# EAGLE schematic MeeBooster_synth (EAGLE 7.5.0)
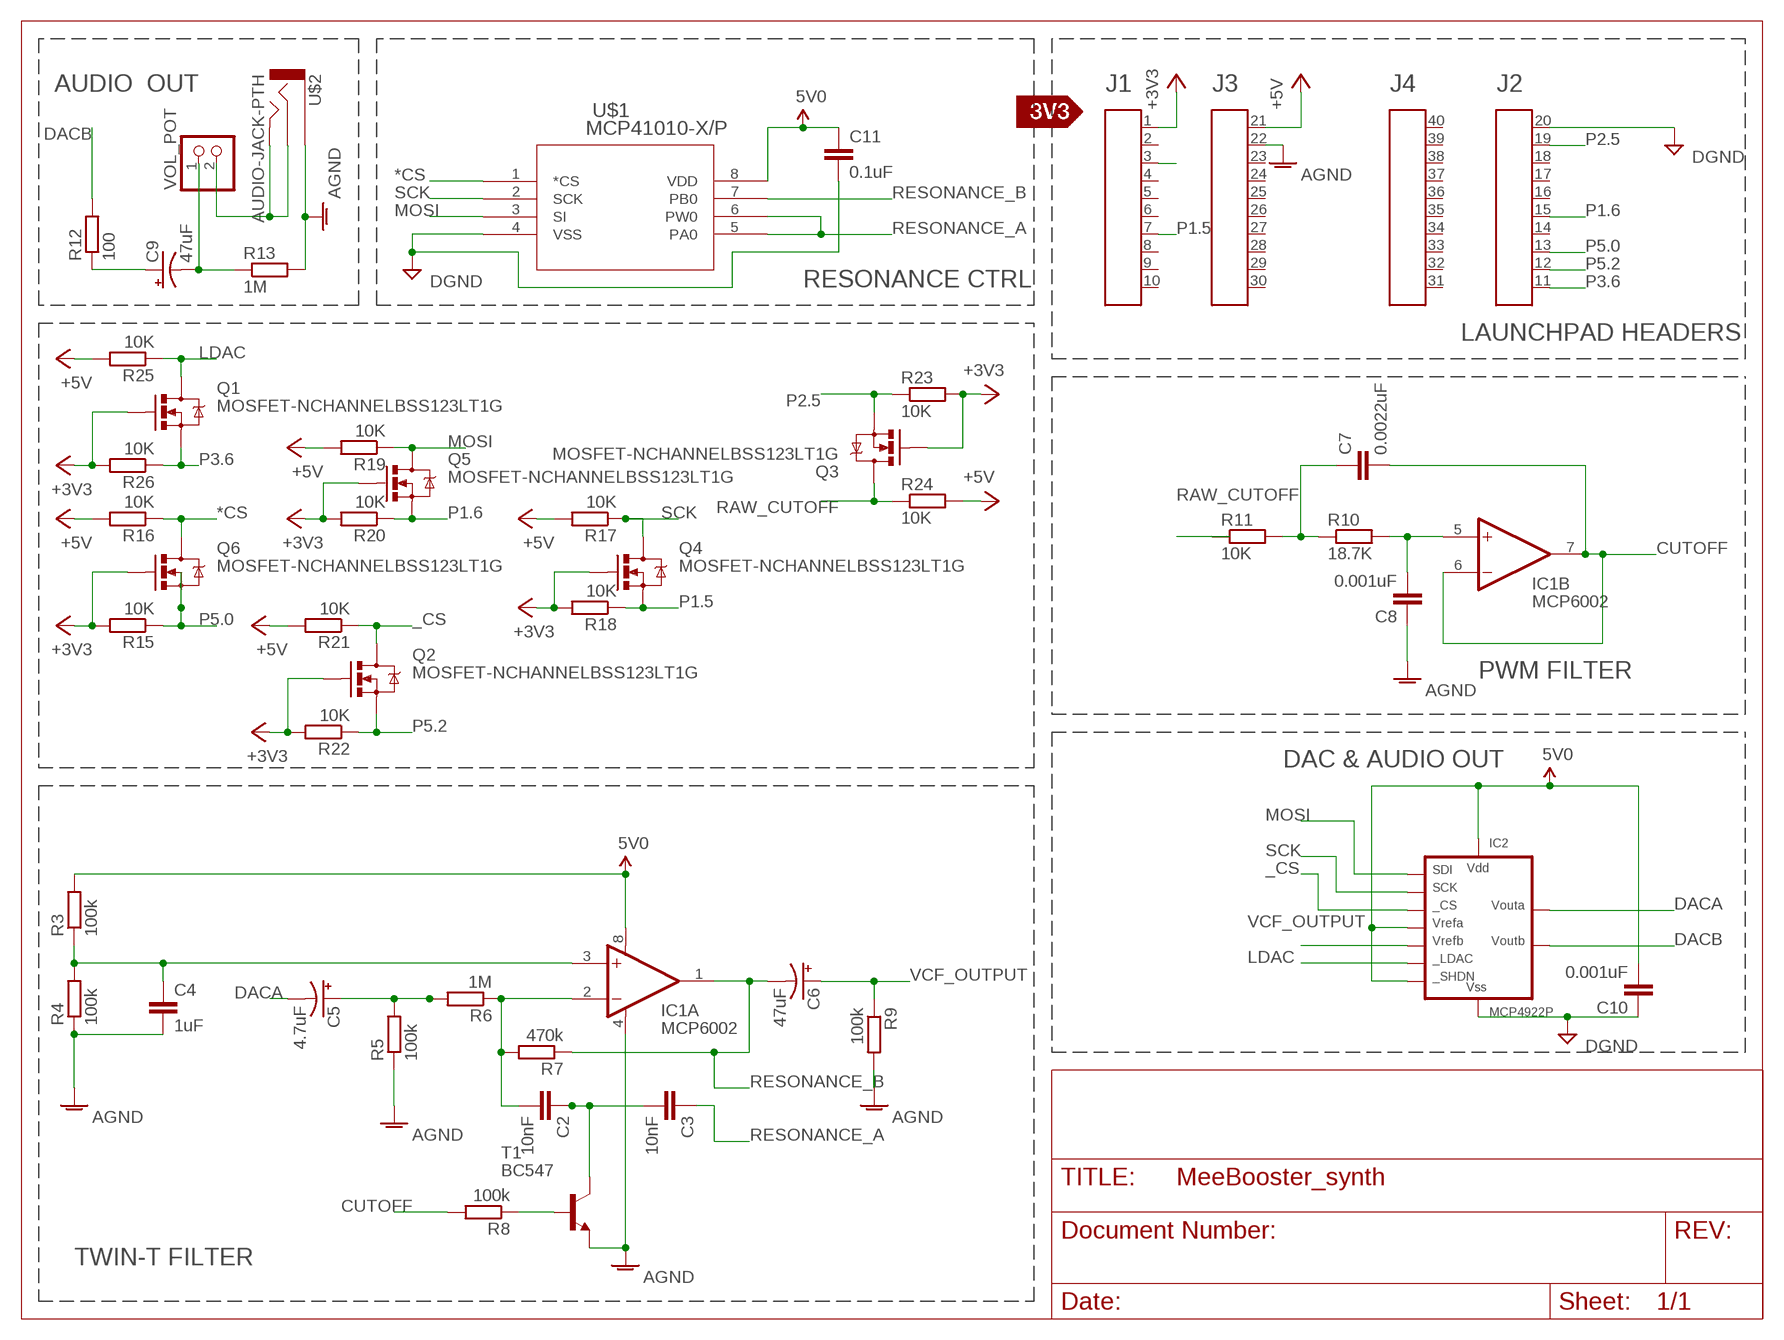
[diagram p0: schematic, sheet 1]

## Parts
A1  HEADER4X10-BOOSTERPACK  [4X10-BOOSTERPACK]
C2  10nF  CAP0603-CAP  [0603-CAP]
C3  10nF  CAP0603-CAP  [0603-CAP]
C4  1uF  CAP0603-CAP  [0603-CAP]
C5  4.7uF  CAP_POLC  [PANASONIC_C]
C6  47uF  CAP_POLD  [PANASONIC_D]
C7  0.0022uF  CAP0603-CAP  [0603-CAP]
C8  0.001uF  CAP0603-CAP  [0603-CAP]
C9  47uF  CAP_POLD  [PANASONIC_D]
C10  0.001uF  CAP0603-CAP  [0603-CAP]
C11  0.1uF  C-EUC0603  [C0603]
IC1  MCP6002  [DIL08]
IC2  MCP4922P  [DIL14]
Q1  MOSFET-NCHANNELBSS123LT1G  [SOT23-3]
Q2  MOSFET-NCHANNELBSS123LT1G  [SOT23-3]
Q3  MOSFET-NCHANNELBSS123LT1G  [SOT23-3]
Q4  MOSFET-NCHANNELBSS123LT1G  [SOT23-3]
Q5  MOSFET-NCHANNELBSS123LT1G  [SOT23-3]
Q6  MOSFET-NCHANNELBSS123LT1G  [SOT23-3]
R3  100k  R-EU_M1206  [M1206]
R4  100k  R-EU_M1206  [M1206]
R5  100k  R-EU_M1206  [M1206]
R6  1M  R-EU_M1206  [M1206]
R7  470k  R-EU_M1206  [M1206]
R8  100k  R-EU_M1206  [M1206]
R9  100k  R-EU_M1206  [M1206]
R10  18.7K  R-EU_M1206  [M1206]
R11  10K  R-EU_M1206  [M1206]
R12  100  R-EU_M1206  [M1206]
R13  1M  R-EU_M1206  [M1206]
R15  10K  R-EU_M1206  [M1206]
R16  10K  R-EU_M1206  [M1206]
R17  10K  R-EU_M1206  [M1206]
R18  10K  R-EU_M1206  [M1206]
R19  10K  R-EU_M1206  [M1206]
R20  10K  R-EU_M1206  [M1206]
R21  10K  R-EU_M1206  [M1206]
R22  10K  R-EU_M1206  [M1206]
R23  10K  R-EU_M1206  [M1206]
R24  10K  R-EU_M1206  [M1206]
R25  10K  R-EU_M1206  [M1206]
R26  10K  R-EU_M1206  [M1206]
T1  BC547  [TO92]
U$1  MCP41010-X/P  [PDIP8_300MC]
U$2  AUDIO-JACK-PTH  [AUDIO-JACK]
U$3  SILK_3V3_TAG  [SILK_3V3_TAG]
VOL_POT  PINHD-1X2  [1X02]

## Nets
5V: A1.1 C10.2 C11.1 IC1.8(A:V+) IC2.1(VDD) IC2.9(SHDN) IC2.13(VREFA) R3.2 U$1.8(VDD) ; supply symbol labelled 5V0
*CS: Q6.3(D) R16.1 U$1.1(*CS)
+3V3: Q1.1(G) Q2.1(G) Q3.1(G) Q4.1(G) Q5.1(G) Q6.1(G) R15.2 R18.2 R20.2 R22.2 R23.2 R26.2
+5V: A1.21 R16.2 R17.2 R19.2 R21.2 R24.2 R25.2
_CS: IC2.3(CS) Q2.3(D) R21.1
AGND: A1.22 C4.2 C8.1 IC1.4(A:V-) R4.1 R5.1 R9.2 R13.2 T1.1(E) U$2.1
CUTOFF: C7.2 IC1.6(B:-IN) IC1.7(B:OUT) R8.2
DACA: C5.- IC2.14(VOUTA)
DACB: IC2.10(VOUTB) R12.2
DGND: A1.20 C10.1 C11.2 IC2.12(VSS) U$1.4(VSS)
FROM_VOL_POT: U$2.2 U$2.5 VOL_POT.2
LDAC: IC2.8(LDAC) Q1.3(D) R25.1
MOSI: IC2.5(SDI) Q5.3(D) R19.1 U$1.3(SI)
N$4: C4.1 IC1.3(A:+IN) R3.1 R4.2
N$5: C9.+ R12.1
N$6: C2.2 IC1.2(A:-IN) R6.1 R7.2
N$7: C2.1 C3.2 T1.3(C)
N$8: C5.+ R5.2 R6.2
N$9: R8.1 T1.2(B)
N$10: C8.2 IC1.5(B:+IN) R10.2
N$11: C7.1 R10.1 R11.2
P1.5: A1.7 Q4.2(S) R18.1
P1.6: A1.15 Q5.2(S) R20.1
P2.5: A1.19 Q3.2(S) R23.1
P3.6: A1.11 Q1.2(S) R26.1
P5.0: A1.13 Q6.2(S) R15.1
P5.2: A1.12 Q2.2(S) R22.1
RAW_CUTOFF: Q3.3(D) R11.1 R24.1
RESONANCE_A: C3.1 U$1.5(PA0) U$1.6(PW0)
RESONANCE_B: C6.- IC1.1(A:OUT) R7.1 U$1.7(PB0)
RX: A1.3
SCK: IC2.4(SCK) Q4.3(D) R17.1 U$1.2(SCK)
TO_VOL_POT: C9.- R13.1 VOL_POT.1
VCF_OUTPUT: C6.+ IC2.11(VREFB) R9.1
Unconnected: A1.2 A1.4 A1.5 A1.6 A1.8 A1.9 A1.10 A1.14 A1.16 A1.17 A1.18 A1.23 A1.24 A1.25 A1.26 A1.27 A1.28 A1.29 A1.30 A1.31 A1.32 A1.33 A1.34 A1.35 A1.36 A1.37 A1.38 A1.39 A1.40

## Notes on the sheet
- AUDIO  OUT
- RESONANCE CTRL
- LAUNCHPAD HEADERS
- PWM FILTER
- DAC & AUDIO OUT
- TWIN-T FILTER

## Library data of the parts
A1 = Public_BP_Library:HEADER4X10-BOOSTERPACK
C2-C4 C7 C8 C10 = SparkFun:CAP: Capacitor Standard 0603 ceramic capacitor, and 0.1" leaded capacitor.
C5 C6 C9 = SparkFun:CAP_POL: Capacitor Polarized These are standard SMD and PTH capacitors. Normally 10uF, 47uF, and 100uF in electrolytic and tantalum varieties. Always verify the external diameter of the through hole cap, it varies with capacity, voltage, and manufacturer. The EIA devices should be standard.
C11 = rcl:C-EU: CAPACITOR, European symbol
IC1 = meeblip:MCP6002: Dual Op Amp
IC2 = microchip-dac:MCP4922: MCP4922: 12-bit DAC MCP4902/4912/4922 - 8/10/12-Bit Dual Voltage Output Digital-to-Analog Converter with SPI Interface The MCP49x2 devices are dual 8-bit, 10-bit, and 12-bit buffered voltage output Digital-to-Analog Converters (DACs), respectively. The devices operate from a single 2.7V to 5.5V supply with SPI compatible Serial Peripheral Interface. The user can configure the full-scale range of the device to be VREF or 2 * VREF by setting the Gain Selection Option bit (gain of 1 of 2). RobG
Q1-Q6 = SparkFun-DiscreteSemi:MOSFET-NCHANNEL: Common NMOSFET Parts MFG P/N Store ID Prod ID FDD8780 TRANS-09984 SI7820DN TRANS-11055 FDS6630A IC-08089 2N7002PW TRANS-11151 FQP30N06L COM-10213 TRANS-10060 BSS123LT1G TRANS-08345 BSS138 TRANS-00830 BS170 2N7000; PROD_ID: TRANS-08345
R3-R13 R15-R26 = rcl:R-EU_: RESISTOR, European symbol
T1 = transistor:BC547: NPN TRANSISTOR
U$1 = MCP41010-X_P:MCP41010-X/P
U$2 = meeblip:AUDIO-JACK: 3.5mm Audio Jack 3.5mm PCB mount audio jack. Sparkfun SKU: PRT-08032 (from SparkFun library)
U$3 = Public_BP_Library:SILK_3V3_TAG
VOL_POT = meeblip:PINHD-1X2: PIN HEADER